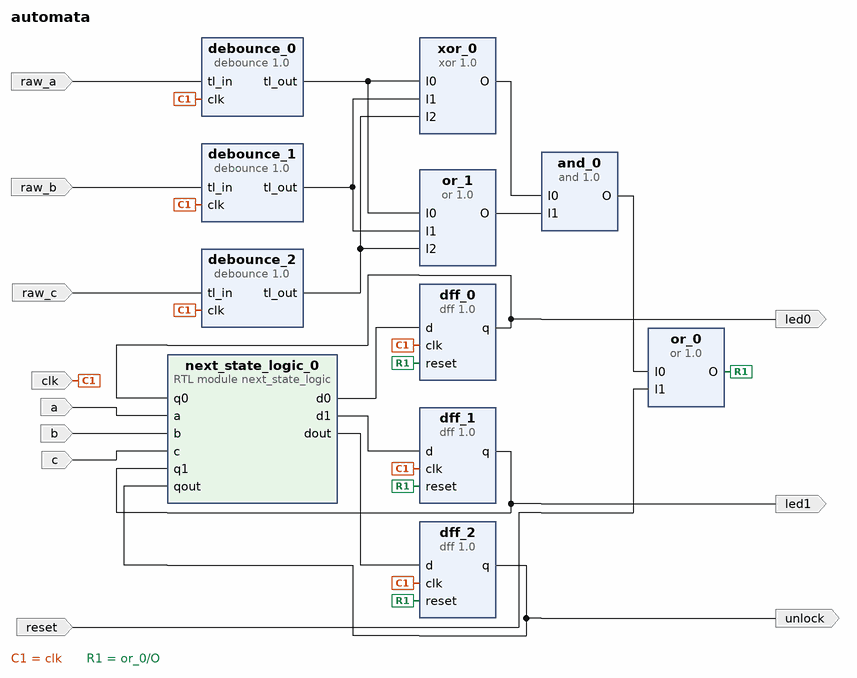
[diagram p0: block diagram of the top level]
# Vivado block design automata, xc7a35tcpg236-1, Vivado 2018.3
create_bd_design automata

create_bd_port -dir I raw_a
create_bd_port -dir I raw_b
create_bd_port -dir I raw_c
create_bd_port -dir I a
create_bd_port -dir I b
create_bd_port -dir I c
create_bd_port -dir I clk
create_bd_port -dir O unlock
create_bd_port -dir O led0
create_bd_port -dir O led1
create_bd_port -dir I reset

create_bd_cell -type ip -vlnv FIT:user:dff:1.0 dff_0
create_bd_cell -type ip -vlnv FIT:user:dff:1.0 dff_1
create_bd_cell -type ip -vlnv FIT:user:or:1.0 or_0
create_bd_cell -type ip -vlnv FIT:user:xor:1.0 xor_0
set_property -dict {CONFIG.Inputs 3 CONFIG.O_inverted true} [get_bd_cells xor_0]
create_bd_cell -type ip -vlnv FIT:user:or:1.0 or_1
set_property -dict {CONFIG.Inputs 3} [get_bd_cells or_1]
create_bd_cell -type ip -vlnv FIT:user:and:1.0 and_0
create_bd_cell -type ip -vlnv FIT:user:debounce:1.0 debounce_0
create_bd_cell -type ip -vlnv FIT:user:debounce:1.0 debounce_1
create_bd_cell -type ip -vlnv FIT:user:debounce:1.0 debounce_2
create_bd_cell -type ip -vlnv FIT:user:dff:1.0 dff_2
set_property -dict {CONFIG.Reset true} [get_bd_cells dff_2]
create_bd_cell -type module -reference next_state_logic next_state_logic_0

# ---- connections ----

connect_bd_net [get_bd_pins next_state_logic_0/d0] [get_bd_pins dff_0/d]
connect_bd_net [get_bd_pins next_state_logic_0/d1] [get_bd_pins dff_1/d]
connect_bd_net [get_bd_pins dff_0/q] [get_bd_ports led0] [get_bd_pins next_state_logic_0/q0]
connect_bd_net [get_bd_pins dff_1/q] [get_bd_ports led1] [get_bd_pins next_state_logic_0/q1]
connect_bd_net [get_bd_ports a] [get_bd_pins next_state_logic_0/a]
connect_bd_net [get_bd_ports b] [get_bd_pins next_state_logic_0/b]
connect_bd_net [get_bd_ports c] [get_bd_pins next_state_logic_0/c]
connect_bd_net [get_bd_ports clk] \
  [get_bd_pins dff_0/clk] [get_bd_pins dff_1/clk] [get_bd_pins debounce_2/clk] [get_bd_pins debounce_1/clk] \
  [get_bd_pins debounce_0/clk] [get_bd_pins dff_2/clk]
connect_bd_net [get_bd_ports reset] [get_bd_pins or_0/I1]
connect_bd_net [get_bd_pins or_0/O] [get_bd_pins dff_0/reset] [get_bd_pins dff_1/reset] [get_bd_pins dff_2/reset]
connect_bd_net [get_bd_pins xor_0/O] [get_bd_pins and_0/I0]
connect_bd_net [get_bd_pins and_0/O] [get_bd_pins or_0/I0]
connect_bd_net [get_bd_ports raw_a] [get_bd_pins debounce_0/tl_in]
connect_bd_net [get_bd_ports raw_b] [get_bd_pins debounce_1/tl_in]
connect_bd_net [get_bd_ports raw_c] [get_bd_pins debounce_2/tl_in]
connect_bd_net [get_bd_pins debounce_0/tl_out] [get_bd_pins xor_0/I0] [get_bd_pins or_1/I0]
connect_bd_net [get_bd_pins debounce_1/tl_out] [get_bd_pins xor_0/I1] [get_bd_pins or_1/I1]
connect_bd_net [get_bd_pins debounce_2/tl_out] [get_bd_pins xor_0/I2] [get_bd_pins or_1/I2]
connect_bd_net [get_bd_pins dff_2/q] [get_bd_ports unlock] [get_bd_pins next_state_logic_0/qout]
connect_bd_net [get_bd_pins next_state_logic_0/dout] [get_bd_pins dff_2/d]
connect_bd_net [get_bd_pins or_1/O] [get_bd_pins and_0/I1]

validate_bd_design
save_bd_design
